# Altium schematic sheet sync_rectification_module_smd.SchDoc
size A3; SheetNumber: 1; SheetTotal: 1
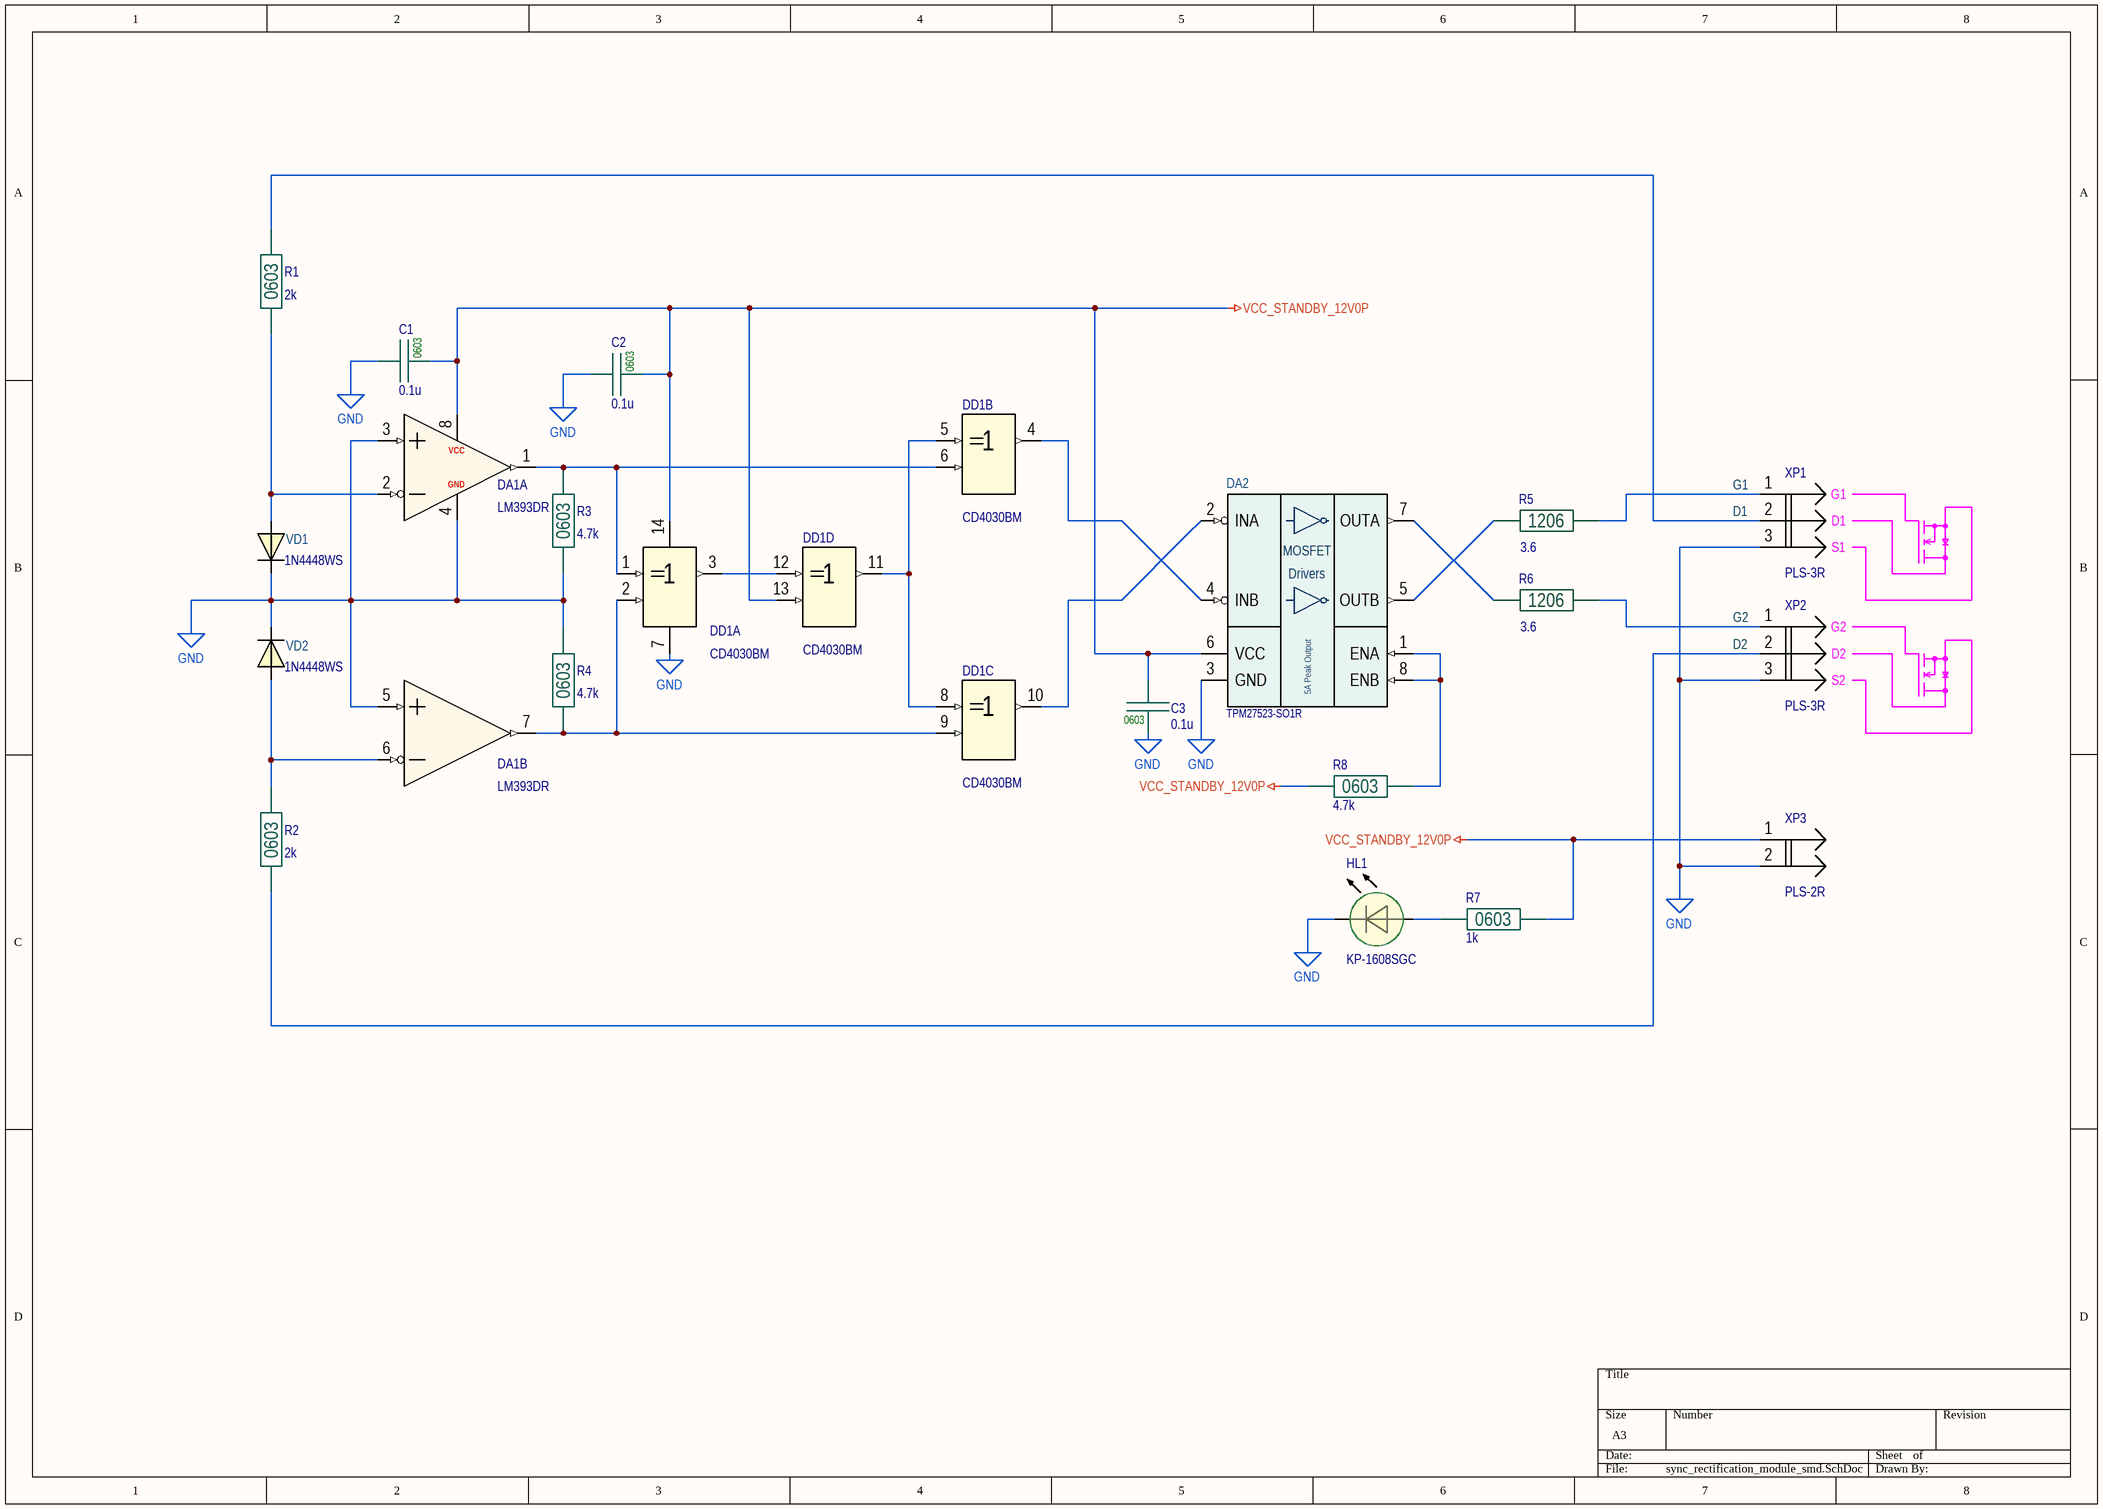
[diagram p0: sync_rectification_module_smd.SchDoc]

## Parts
C1  0.1u  Package: 0603  [CAP0603]
C2  0.1u  Package: 0603  [CAP0603]
C3  0.1u  Package: 0603  [CAP0603]
DA1  LM393DR  [SOIC-8]  (parts A,B of 2)
DA2  TPM27523-SO1R  [SOIC-8]
DD1  CD4030BM  [SOIC-14]  (parts A,B,C,D of 4)
HL1  KP-1608SGC  [LED0603G]
R1  2k  Package: 0603  [RES0603B]
R2  2k  Package: 0603  [RES0603B]
R3  4.7k  Package: 0603  [RES0603B]
R4  4.7k  Package: 0603  [RES0603B]
R5  3.6  Package: 1206  [RES1206B]
R6  3.6  Package: 1206  [RES1206B]
R7  1k  Package: 0603  [RES0603B]
R8  4.7k  Package: 0603  [RES0603B]
VD1  1N4448WS  [SOD-323F]
VD2  1N4448WS  [SOD-323F]
XP1  PLS-3R  [PLS-3R]
XP2  PLS-3R  [PLS-3R]
XP3  PLS-2R  [PLS-2R]

## Nets
GND: C1.2 C2.2 C3.2 DA1.3(1IN+) DA1.4(GND) DA1.5(2IN+) DA2.3(GND) DD1.7(GND) HL1.1 R3.1 R4.2 VD1.1(C) VD2.1(C) XP1.3 XP2.3 XP3.2
VCC_STANDBY_12V0P: C1.1 C2.1 C3.1 DA1.8(VCC) DA2.6(VCC) DD1.13(B3) DD1.14(VCC) R7.1 R8.2 XP3.1
D1: R1.2 XP1.2
D2: R2.1 XP2.2
G1: R5.2 XP1.1
G2: R6.2 XP2.1
NetDA1_1: DA1.1(1OUT) DD1.1(A0) DD1.6(B1) R3.2
NetDA1_2: DA1.2(1IN-) R1.1 VD1.2(A)
NetDA1_6: DA1.6(2IN-) R2.2 VD2.2(A)
NetDA1_7: DA1.7(2OUT) DD1.2(B0) DD1.9(B2) R4.1
NetDA2_1: DA2.1(ENA) DA2.8(ENB) R8.1
NetDA2_2: DA2.2(INA) DD1.10(Y2)
NetDA2_4: DA2.4(INB) DD1.4(Y1)
NetDA2_5: DA2.5(OUTB) R5.1
NetDA2_7: DA2.7(OUTA) R6.1
NetDD1_3: DD1.3(Y0) DD1.12(A3)
NetDD1_5: DD1.5(A1) DD1.8(A2) DD1.11(Y3)
NetHL1_2: HL1.2 R7.2

## Notes on the sheet
- (near XP1) D1
- (near XP1) G1
- (near XP1) S1
- (near XP2) D2
- (near XP2) G2
- (near XP2) S2
- (in symbol TPM27523-SO1R) MOSFET; Drivers; 5A Peak Output

## Library data of the parts
C1-C3 = C0603: Capacitors 0603 package case; Part Number: CL10B104KB8NNNC; Manufacturer: Samsung Sdi Co. Ltd; Tolerance: ± 10 %; Dielectric: X7R; Voltage: 50V; Value: 0.1u; Value on schem: 0.1u
DA1 = LM393DR: Dual Comparator; Manufacturer: Texas Instruments; Part Number: LM393DR; Package: SO-8
DA2 = TPM27523-SO1R: Dual 5-A High-speed, Low-side Gate Driver; Manufacturer: 3PEAK; Package: SOIC8 (150 mil); Part Number: TPM27523-SO1R
DD1 = CD4030BM: Quad XOR-Gate; Manufacturer: Texas Instruments; Part Number: CD4030BM; Package: SOIC-14
HL1 = KP-1608SGC: Super bright green led (package case 0603); Manufacturer: Kingbright Company LLC.; Designator: HL*; Package: 0603; Part Number: KP-1608SGC; Color: Super bright green
R1 R2 = R0603: Resistor 0603 package case; Part Number: RC0603FR-072KL; Manufacturer: Yageo; Tolerance: ± 1 %; Value: 2k; Value on schem: 2k
R3 R4 R8 = R0603: Resistor 0603 package case; Part Number: RC0603FR-074K7L; Manufacturer: Yageo; Tolerance: ± 1 %; Value: 4.7k; Value on schem: 4.7k
R5 R6 = R1206: Resistor 1206 package case; Manufacturer: Yageo; Part Number: RC1206FR-073R6L; Tolerance: ± 1 %; Voltage: 200V; Temperature Coefficient: ±200/°C; Value: 3.6; Value on schem: 3.6
R7 = R0603: Resistor 0603 package case; Part Number: RC0603FR-071KL; Manufacturer: Yageo; Tolerance: ± 1 %; Value: 1k; Value on schem: 1k
VD1 VD2 = 1N4448WS: Diode 75V, 150mA; Manufacturer: ON Semiconductor; Package: SOD-323F; Part Number: 1N4448WS
XP1 XP2 = PLS-3R: Value: PLS-3R
XP3 = PLS-2R: Value: PLS-2R